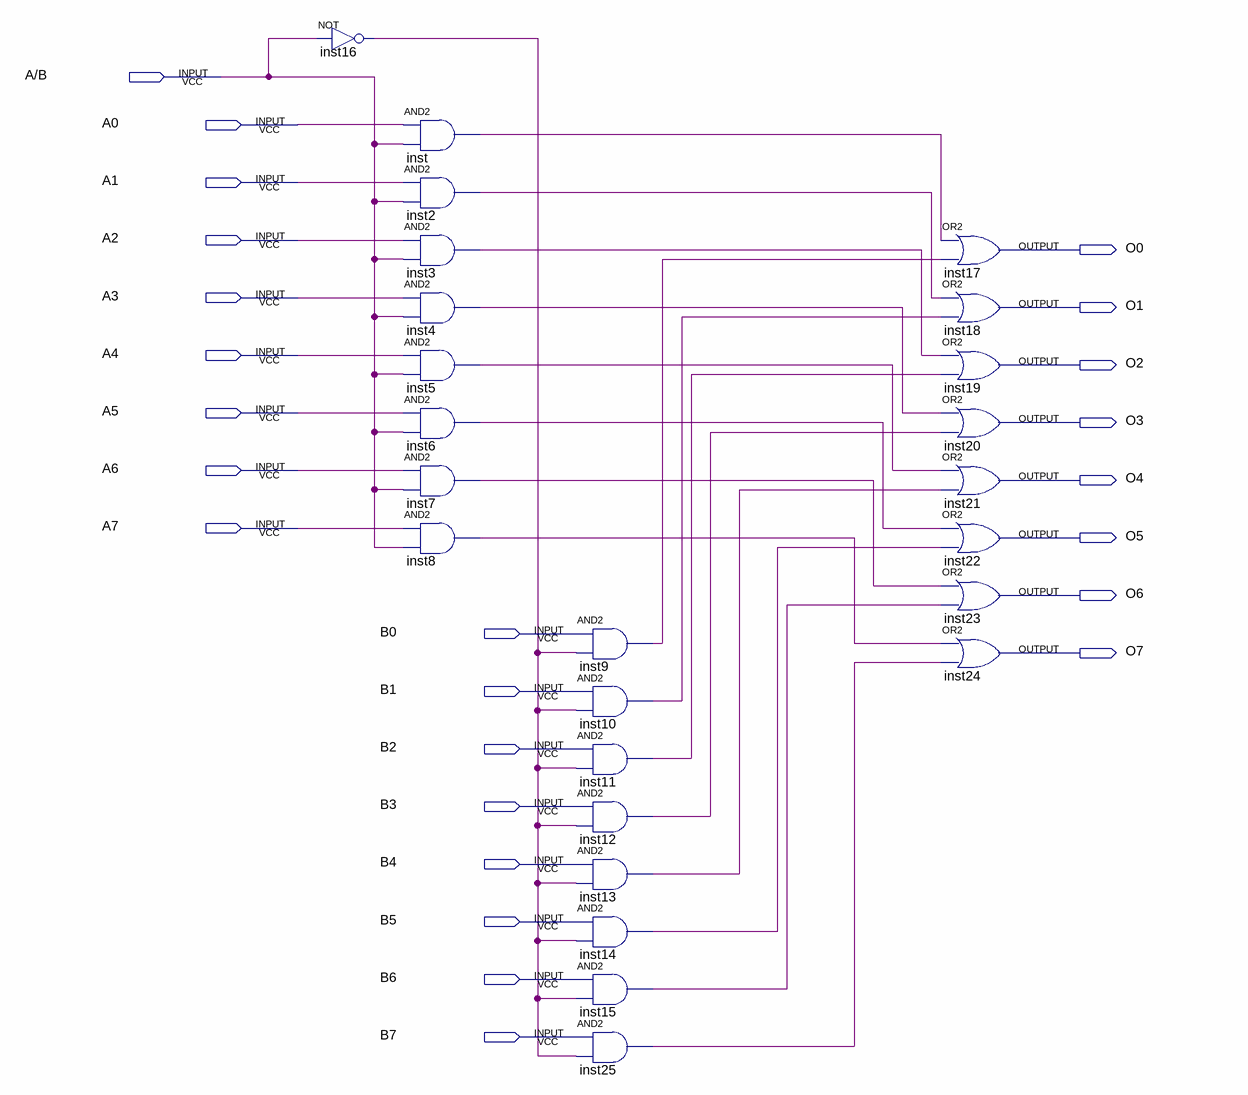
[diagram p0: schematic sheet]
// Quartus schematic sel2.bdf as structural Verilog: 25 symbols, 25 pins
module sel2 (
  input  \A/B ,
  input  A0,
  input  A1,
  input  A2,
  input  A3,
  input  A4,
  input  A5,
  input  A6,
  input  A7,
  input  B0,
  input  B1,
  input  B2,
  input  B3,
  input  B4,
  input  B5,
  input  B6,
  input  B7,
  output O0,
  output O1,
  output O2,
  output O3,
  output O4,
  output O5,
  output O6,
  output O7
);

  wire inst2_out, inst3_out, inst4_out, inst5_out, inst6_out, inst7_out, inst8_out, inst9_out, inst10_out,
       inst11_out, inst12_out, inst13_out, inst14_out, inst15_out, inst16_out, inst25_out, inst_out;

  not inst16 (inst16_out, \A/B );
  and inst (inst_out, A0, \A/B );
  and inst2 (inst2_out, A1, \A/B );
  and inst3 (inst3_out, A2, \A/B );
  and inst4 (inst4_out, A3, \A/B );
  and inst5 (inst5_out, A4, \A/B );
  and inst6 (inst6_out, A5, \A/B );
  and inst7 (inst7_out, A6, \A/B );
  and inst8 (inst8_out, A7, \A/B );
  and inst9 (inst9_out, B0, inst16_out);
  and inst10 (inst10_out, B1, inst16_out);
  and inst11 (inst11_out, B2, inst16_out);
  and inst12 (inst12_out, B3, inst16_out);
  and inst13 (inst13_out, B4, inst16_out);
  and inst14 (inst14_out, B5, inst16_out);
  and inst15 (inst15_out, B6, inst16_out);
  and inst25 (inst25_out, B7, inst16_out);
  or inst17 (O0, inst_out, inst9_out);
  or inst18 (O1, inst2_out, inst10_out);
  or inst19 (O2, inst3_out, inst11_out);
  or inst20 (O3, inst4_out, inst12_out);
  or inst21 (O4, inst5_out, inst13_out);
  or inst22 (O5, inst6_out, inst14_out);
  or inst23 (O6, inst7_out, inst15_out);
  or inst24 (O7, inst8_out, inst25_out);
endmodule
